# Altium schematic sheet PowerSupply.SchDoc
size 457 x 127 mm; SheetNumber: 2; SheetTotal: 5
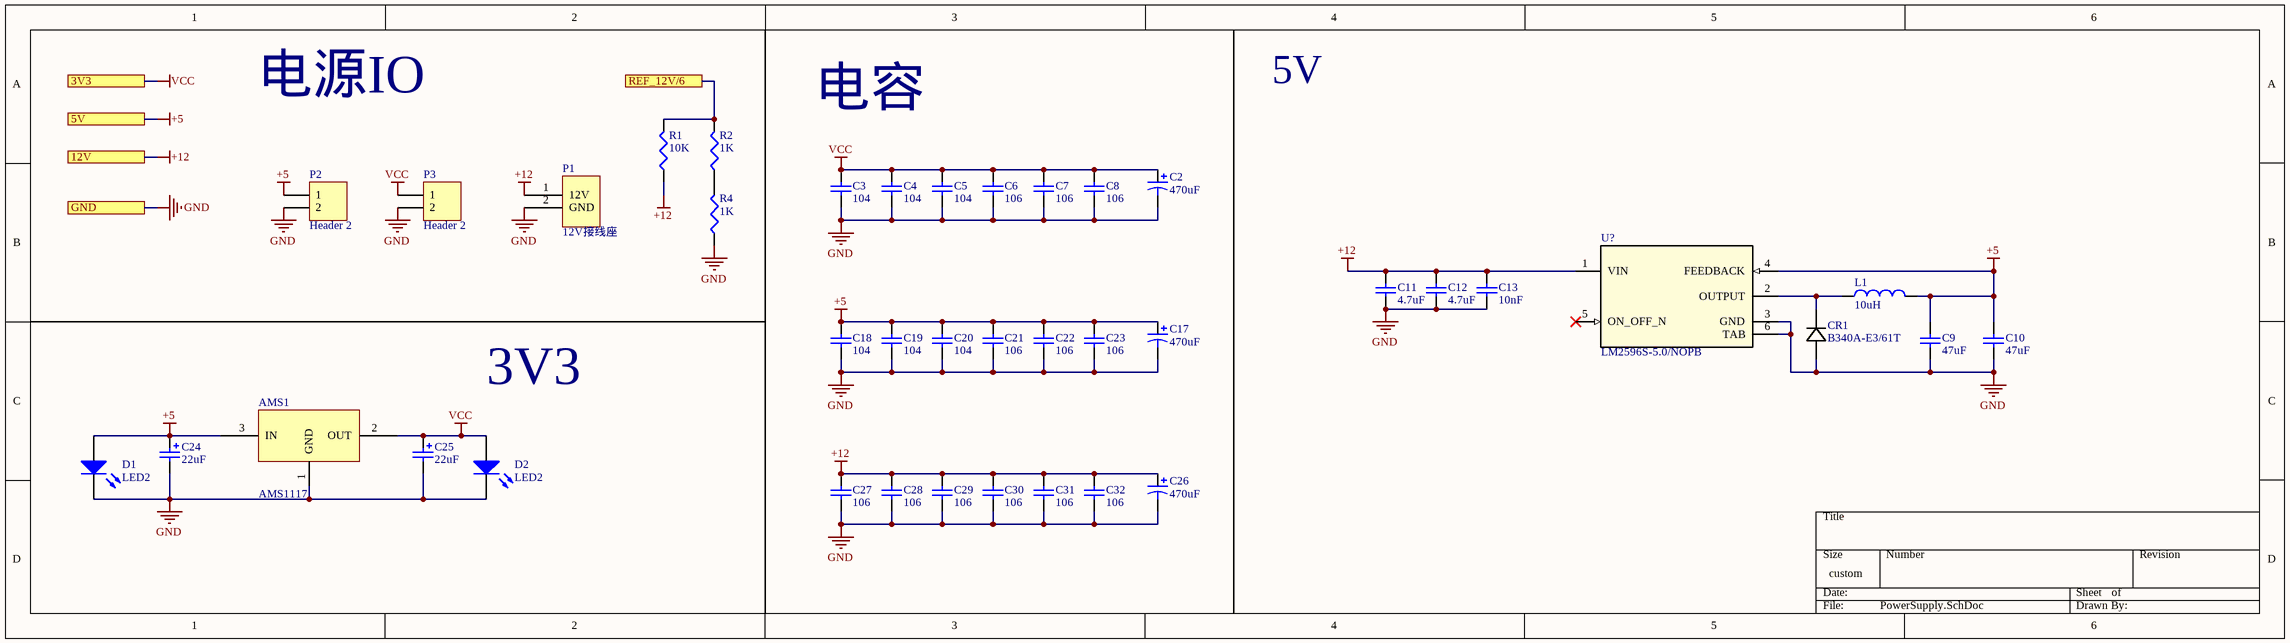
[diagram p0: PowerSupply.SchDoc]

## Parts
AMS1  AMS1117  [AMS1117]
C2  470uF  [电解电容10*10.5mm]
C3  104  [MY0805]
C4  104  [MY0805]
C5  104  [MY0805]
C6  106  [MY0805]
C7  106  [MY0805]
C8  106  [MY0805]
C9  47uF  [MY0805]
C10  47uF  [MY0805]
C11  4.7uF  [MY0805]
C12  4.7uF  [MY0805]
C13  10nF  [MY0805]
C17  470uF  [电解电容10*10.5mm]
C18  104  [MY0805]
C19  104  [MY0805]
C20  104  [MY0805]
C21  106  [MY0805]
C22  106  [MY0805]
C23  106  [MY0805]
C24  22uF  [MY0805]
C25  22uF  [MY0805]
C26  470uF  [电解电容10*10.5mm]
C27  106  [MY0805]
C28  106  [MY0805]
C29  106  [MY0805]
C30  106  [MY0805]
C31  106  [MY0805]
C32  106  [MY0805]
CR1  B340A-E3/61T  [DO-214AC_VIS]
D1  LED2  [MY0805]
D2  LED2  [MY0805]
L1  10uH  [电感0603_10uH]
P1  12V接线座  [16A_5.0mm接线座]
P2  Header 2  [POWER_PORT]
P3  Header 2  [POWER_PORT]
R1  10K  [MY0805]
R2  1K  [MY0805]
R4  1K  [MY0805]
U?  LM2596S-5.0/NOPB  [KTT0005B]

## Ports
3V3, 5V, 12V, GND, REF_12V/6

## Nets
+5: AMS1.3(IN) C9.2 C10.2 C17.1 C18.2 C19.2 C20.2 C21.2 C22.2 C23.2 C24.1 D1.1(A) L1.2 P2.1 U?.4(FEEDBACK) ; port 5V
+12: C11.2 C12.2 C13.2 C26.1 C27.2 C28.2 C29.2 C30.2 C31.2 C32.2 P1.1(12V) R1.1 U?.1(VIN) ; port 12V
GND: AMS1.1(GND) C2.2 C3.1 C4.1 C5.1 C6.1 C7.1 C8.1 C9.1 C10.1 C11.1 C12.1 C13.1 C17.2 C18.1 C19.1 C20.1 C21.1 C22.1 C23.1 C24.2 C25.2 C26.2 C27.1 C28.1 C29.1 C30.1 C31.1 C32.1 CR1.2 D1.2(K) D2.2(K) P1.2(GND) P2.2 P3.2 R4.1 U?.3(GND) U?.6(TAB) ; port GND
VCC: AMS1.2(OUT) C2.1 C3.2 C4.2 C5.2 C6.2 C7.2 C8.2 C25.1 D2.1(A) P3.1 ; port 3V3
REF_12V/6: R1.2 R2.2 ; port REF_12V/6
NetCR1_1: CR1.1 L1.1 U?.2(OUTPUT)
NetR2_1: R2.1 R4.2

Not connected (* = marked no-connect by the designer): U? 5(ON_OFF_N)*

## Notes on the sheet
- 5V
- 电源IO
- 电容
- 3V3

## Library data of the parts
C2 C17 C26 = Cap Pol1: Polarized Capacitor (Radial); Value: 100pF; Published: 8-Jun-2000; LatestRevisionDate: 17-Jul-2002; LatestRevisionNote: Re-released for DXP Platform.; PackageReference: RB7.6-15; Publisher: Altium Limited; PackageDescription: Polarized Capacitor (Radial); 2 Leads
C3-C5 C11 C12 C21-C23 C27-C32 = Cap: Capacitor; Published: 8-Jun-2000; LatestRevisionDate: 17-Jul-2002; LatestRevisionNote: Re-released for DXP Platform.; PackageReference: RAD-0.3; Publisher: Altium Limited; PackageDescription: Radial Cap, Thru-Hole; 2 Leads; 0.3 in Pin Spacing
  C3-C5: Value: 104
  C11 C12: Value: 4.7uF
  C21-C23 C27-C32: Value: 106
C6-C8 = Cap: Capacitor; Value: 104; Published: 8-Jun-2000; LatestRevisionDate: 17-Jul-2002; LatestRevisionNote: Re-released for DXP Platform.; PackageReference: RAD-0.3; Publisher: Altium Limited; PackageDescription: Radial Cap, Thru-Hole; 2 Leads; 0.3 in Pin Spacing
C9 C10 C13 = Cap: Capacitor; Value: 4.7uF; Published: 8-Jun-2000; LatestRevisionDate: 17-Jul-2002; LatestRevisionNote: Re-released for DXP Platform.; PackageReference: RAD-0.3; Publisher: Altium Limited; PackageDescription: Radial Cap, Thru-Hole; 2 Leads; 0.3 in Pin Spacing
C18-C20 = Cap: Capacitor; Value: 106; Published: 8-Jun-2000; LatestRevisionDate: 17-Jul-2002; LatestRevisionNote: Re-released for DXP Platform.; PackageReference: RAD-0.3; Publisher: Altium Limited; PackageDescription: Radial Cap, Thru-Hole; 2 Leads; 0.3 in Pin Spacing
C24 C25 = Cap Pol2: Polarized Capacitor (Axial); Published: 8-Jun-2000; LatestRevisionDate: 17-Jul-2002; LatestRevisionNote: Re-released for DXP Platform.; PackageReference: POLAR0.8; Publisher: Altium Limited; PackageDescription: Polarized Capacitor; 2 Leads; Value: 22uF
CR1 = B340A-E3/61T: No Description Available; Mfr_Name: Vishay; Type: DEV; Copyright: Copyright (C) 2022 Ultra Librarian. All rights reserved.; Manufacturer_Part_Number: B340A-E3/61T; RefDes: RefDes
D1 D2 = LED2: Typical RED, GREEN, YELLOW, AMBER GaAs LED; Published: 8-Jun-2000; LatestRevisionDate: 17-Jul-2002; LatestRevisionNote: Re-released for DXP Platform.; PackageVersion: Feb-2002; PackageReference: 3.2X1.6X1.1; Publisher: Altium Limited; PackageDescription: SM LED; 2 Flat Leads
L1 = Inductor: Code_IEC: 1005; Published: 8-Jun-2000; LatestRevisionDate: 29-May-2009; LatestRevisionNote: IPC-7351 Footprint Added.; PackageReference: 0402-A; Publisher: Altium Limited; PackageDescription: Chip Inductor; Code_JEITA: 0402; Value: 10uH
P2 P3 = Header 2: Header, 2-Pin; LatestRevisionDate: 17-Jul-2002; LatestRevisionNote: Re-released for DXP Platform.; Publisher: Altium Limited
R1 R2 R4 = Res3: Resistor; Published: 8-Jun-2000; LatestRevisionDate: 29-May-2009; LatestRevisionNote: IPC-7351 Footprint Added.; PackageReference: J1-0603; Publisher: Altium Limited; PackageDescription: Chip Resistor
  R1: Value: 10K
  R2 R4: Value: 1K
U? = LM2596S-5.0/NOPB: No Description Available; Mfr_Name: Texas Instruments; PartNumber: LM2596SX-ADJ/NOPB; Alternate_PartNumber: LM2596S-ADJ/NOPB; CompType: IC; Type: DEV; RefDes: RefDes; Copyright: Copyright (C) 2022 Ultra Librarian. All rights reserved.; Manufacturer_Part_Number: LM2596S-5.0/NOPB; PackageReference: KTT0005B; MountType: SMT; RoHS: Y; Manufacturer: Texas Instruments